# Altium schematic sheet Ethernet.SchDoc
size A4; Revision: B.2(PCB.SCH)
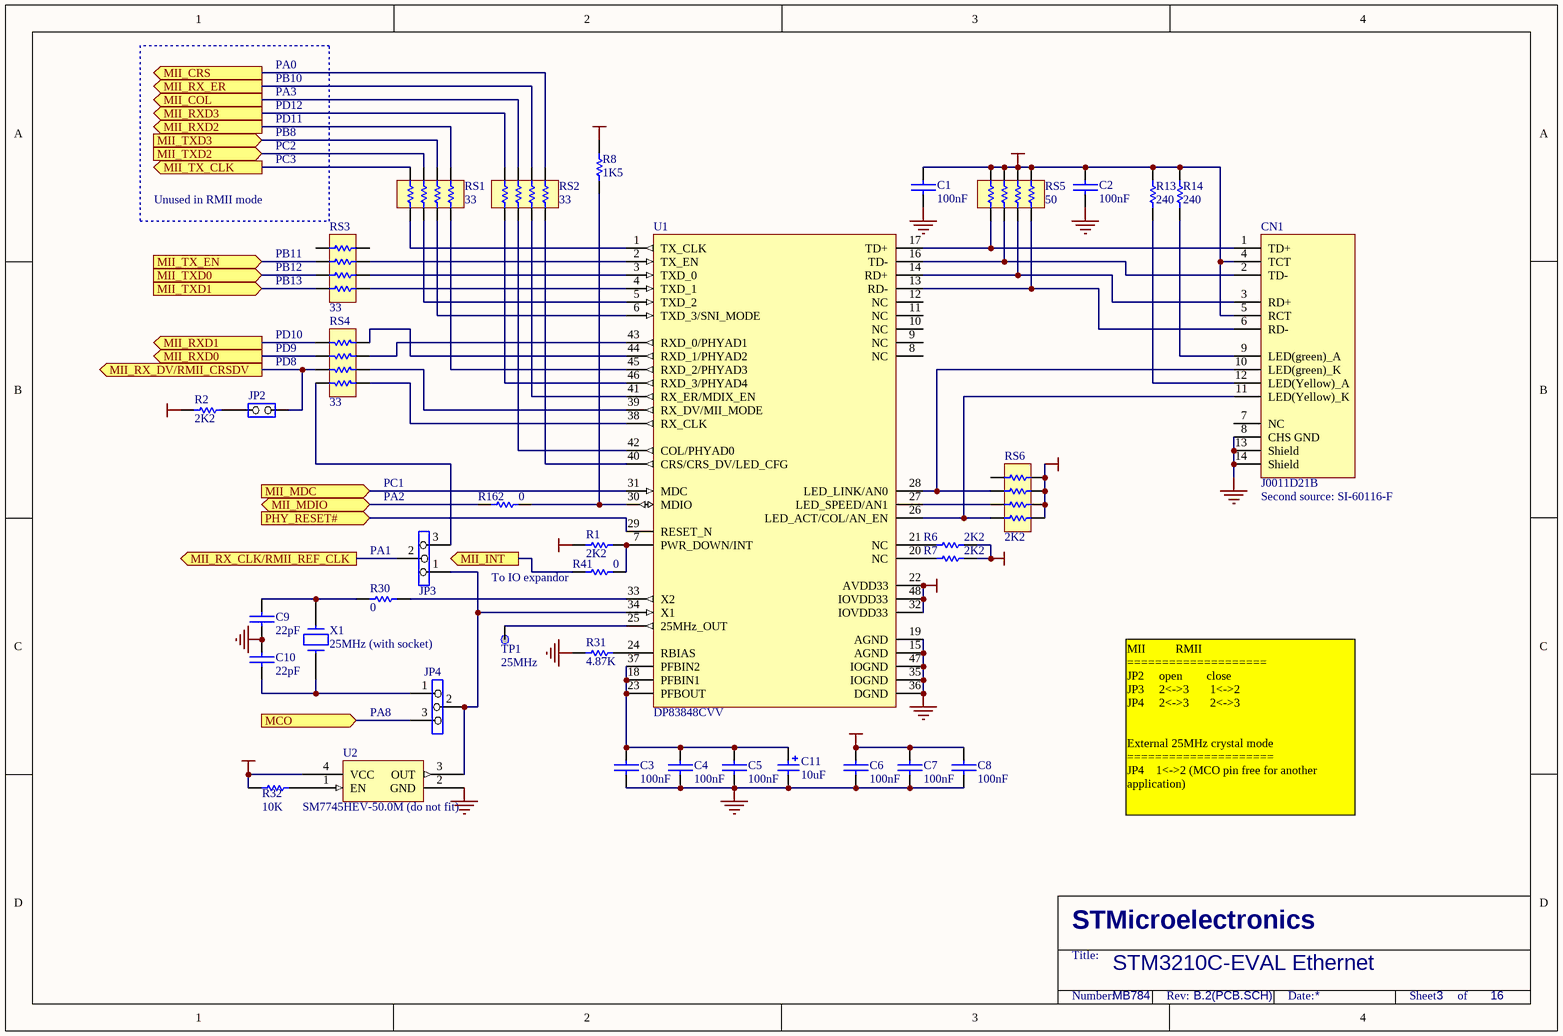
[diagram p0: Ethernet.SchDoc]

## Parts
C1  100nF  [0603C]
C2  100nF  [0603C]
C3  100nF  [0603C]
C4  100nF  [0603C]
C5  100nF  [0603C]
C6  100nF  [0603C]
C7  100nF  [0603C]
C8  100nF  [0603C]
C9  22pF  [0603R]
C10  22pF  [0603R]
C11  10uF  [TAN-A]
CN1  J0011D21B  [J0011D21B]
JP2  (no value)  [SIP2]
JP3  (no value)  [SIP3]
JP4  (no value)  [SIP3]
R1  2K2  [0603R]
R2  2K2  [0603R]
R6  2K2  [0603R]
R7  2K2  [0603R]
R8  1K5  [0603R]
R13  240  [0603R]
R14  240  [0603R]
R30  0  [0603R]
R31  4.87K  [0603R]
R32  10K  [0603R]
R41  0  [0603R]
R162  0  [0603R]
RS1  33  [RES-4B]
RS2  33  [RES-4B]
RS3  33  [RES-4B]
RS4  33  [RES-4B]
RS5  50  [RES-4B]
RS6  2K2  [RES-4B]
TP1  25MHz  [TP]
U1  DP83848CVV  [LQFP48]
U2  SM7745HEV-50.0M (do not fit)  [XTAL_5X7]
X1  25MHz (with socket)  [XTAL1]

## Ports
MCO (in), MII_COL (out), MII_CRS (out), MII_INT (out), MII_MDC (in), MII_MDIO (bidir), MII_RX_CLK/RMII_REF_CLK (out), MII_RX_DV/RMII_CRSDV (out), MII_RX_ER (out), MII_RXD0 (out), MII_RXD1 (out), MII_RXD2 (out), MII_RXD3 (out), MII_TX_CLK (out), MII_TX_EN (in), MII_TXD0 (in), MII_TXD1 (in), MII_TXD2 (in), MII_TXD3 (in), PHY_RESET# (in)

## Nets
+3V3: C1.2 C2.2 C6.1 C7.2 C8.2 CN1.4(TCT) CN1.5(RCT) R1.1 R2.2 R6.2 R7.2 R8.2 R13.2 R14.2 R32.1 RS5.1 RS5.3 RS5.5 RS5.7 RS6.1 RS6.3 RS6.5 RS6.7 U1.22(AVDD33) U1.32(IOVDD33) U1.48(IOVDD33) U2.4(VCC)
GND: C1.1 C2.1 C3.2 C4.1 C5.1 C6.2 C7.1 C8.1 C9.1 C10.2 C11.2 CN1.8(CHS_GND) CN1.13(Shield) CN1.14(Shield) R31.1 U1.15(AGND) U1.19(AGND) U1.35(IOGND) U1.36(DGND) U1.47(IOGND) U2.2(GND)
MCO: JP4.3 ; port MCO
MII_COL: RS2.4 ; port MII_COL
MII_CRS: RS2.8 ; port MII_CRS
MII_INT: R41.1 ; port MII_INT
MII_MDC: U1.31(MDC) ; port MII_MDC
MII_MDIO: R162.1 ; port MII_MDIO
MII_RX_CLK/RMII_REF_CLK: JP3.2 ; port MII_RX_CLK/RMII_REF_CLK
MII_RX_DV/RMII_CRSDV: JP2.1(COMMON) RS4.6 ; port MII_RX_DV/RMII_CRSDV
MII_RX_ER: RS2.6 ; port MII_RX_ER
MII_RXD0: RS4.4 ; port MII_RXD0
MII_RXD1: RS4.2 ; port MII_RXD1
MII_RXD2: RS1.8 ; port MII_RXD2
MII_RXD3: RS2.2 ; port MII_RXD3
MII_TX_CLK: RS1.2 ; port MII_TX_CLK
MII_TX_EN: RS3.6 ; port MII_TX_EN
MII_TXD0: RS3.4 ; port MII_TXD0
MII_TXD1: RS3.2 ; port MII_TXD1
MII_TXD2: RS1.4 ; port MII_TXD2
MII_TXD3: RS1.6 ; port MII_TXD3
PHY_RESET#: U1.29(RESET_N) ; port PHY_RESET#
NetC3_1: C3.1 C4.2 C5.2 C11.1 U1.18(PFBIN1) U1.23(PFBOUT) U1.37(PFBIN2)
NetC9_2: C9.2 R30.2 X1.2
NetC10_1: C10.1 JP4.1 X1.1
NetCN1_1: CN1.1(TD+) RS5.8 U1.17(TD+)
NetCN1_2: CN1.2(TD-) RS5.6 U1.16(TD-)
NetCN1_3: CN1.3(RD+) RS5.4 U1.14(RD+)
NetCN1_6: CN1.6(RD-) RS5.2 U1.13(RD-)
NetCN1_9: CN1.9(LED(green)_A) R14.1
NetCN1_10: CN1.10(LED(green)_K) RS6.6 U1.28(LED_LINK/AN0)
NetCN1_11: CN1.11(LED(Yellow)_K) RS6.2 U1.26(LED_ACT/COL/AN_EN)
NetCN1_12: CN1.12(LED(Yellow)_A) R13.1
NetJP2_2: JP2.2(NO) R2.1
NetJP3_1: JP3.1 JP4.2 U1.34(X1) U2.3(OUT)
NetJP3_3: JP3.3 RS4.8
NetR1_2: R1.2 R41.2 U1.7(PWR_DOWN/INT)
NetR6_1: R6.1 U1.21(NC)
NetR7_1: R7.1 U1.20(NC)
NetR8_1: R8.1 R162.2 U1.30(MDIO)
NetR30_1: R30.1 U1.33(X2)
NetR31_2: R31.2 U1.24(RBIAS)
NetR32_2: R32.2 U2.1(EN)
NetRS1_1: RS1.1 U1.1(TX_CLK)
NetRS1_3: RS1.3 U1.5(TXD_2)
NetRS1_5: RS1.5 U1.6(TXD_3/SNI_MODE)
NetRS1_7: RS1.7 U1.45(RXD_2/PHYAD3)
NetRS2_1: RS2.1 U1.46(RXD_3/PHYAD4)
NetRS2_3: RS2.3 U1.42(COL/PHYAD0)
NetRS2_5: RS2.5 U1.41(RX_ER/MDIX_EN)
NetRS2_7: RS2.7 U1.40(CRS/CRS_DV/LED_CFG)
NetRS3_1: RS3.1 U1.4(TXD_1)
NetRS3_3: RS3.3 U1.3(TXD_0)
NetRS3_5: RS3.5 U1.2(TX_EN)
NetRS4_1: RS4.1 U1.44(RXD_1/PHYAD2)
NetRS4_3: RS4.3 U1.43(RXD_0/PHYAD1)
NetRS4_5: RS4.5 U1.39(RX_DV/MII_MODE)
NetRS4_7: RS4.7 U1.38(RX_CLK)
NetRS6_4: RS6.4 U1.27(LED_SPEED/AN1)
NetTP1_1: TP1.1 U1.25(25MHz_OUT)

Not connected (* = marked no-connect by the designer): CN1 7(NC); RS3 7 8; RS6 8; U1 8(NC) 9(NC) 10(NC) 11(NC) 12(NC)

## Notes on the sheet
- PD12
- PB10
- PA3
- PA0
- PC3
- PC2
- PB8
- PD11
- Unused in RMII mode
- (near RS3) PB11
- (near RS3) PB12
- (near RS3) PB13
- PD9
- (near RS4) PD10
- PD8
- PC1
- (near JP3) PA2
- (near CN1) Second source: SI-60116-F
- PA1
- (near R41) To IO expandor
- PA8
- MII          RMII
  ====================
  JP2     open        close
  JP3     2<->3       1<->2
  JP4     2<->3       2<->3
  External 25MHz crystal mode
  =====================
  JP4    1<->2 (MCO pin free for another application)
- STM3210C-EVAL Ethernet
- MB784
- 3
- 16
- STMicroelectronics
- Title:
- Number:
- Rev:
- Date:
- Sheet       of

## Library data of the parts
C1-C10 = CAP: Capacitor
C11 = Cap Pol1: Polarized Capacitor (Radial); Published: 8-Jun-2000; Revision: July-2002: Re-released for DXP Platform.; Publisher: Altium Limited; Value: 10uF
JP2 = JP2
JP3 JP4 = Jumper3
R1 R2 R6-R8 R13 R14 R30-R32 R41 R162 = Res1: Resistor; Value: 1K; Published: 8-Jun-2000; Revision: July-2002: Re-released for DXP Platform.; Publisher: Altium Limited
RS1-RS6 = Resister Array
TP1 = TP
U2 = SM7745HEV-50.0M
X1 = CRYSTAL